# Altium schematic sheet ART-Pi_Connector.SchDoc: Expansion_Conn
size A3; DocumentNumber: 10; Revision: V1.5; SheetNumber: 10; SheetTotal: 11; PageSetup: Record=PageOptions|CenterHorizontal=True|CenterVertical=True|PrintScale=1.01|XCorrection=1.00|YCorrection=1.00|PrintKind=0|BorderSize=5000000|LeftOffset=0|BottomOffset=0|Orientation=2|PaperLength=1000|PaperWidth=1000|Scale=100|PaperSource=7|PrintQuality=600|MediaType=1|DitherType=10|PrintScaleMode=1|PaperKind=A3(297x420mm)|PaperIndex=8
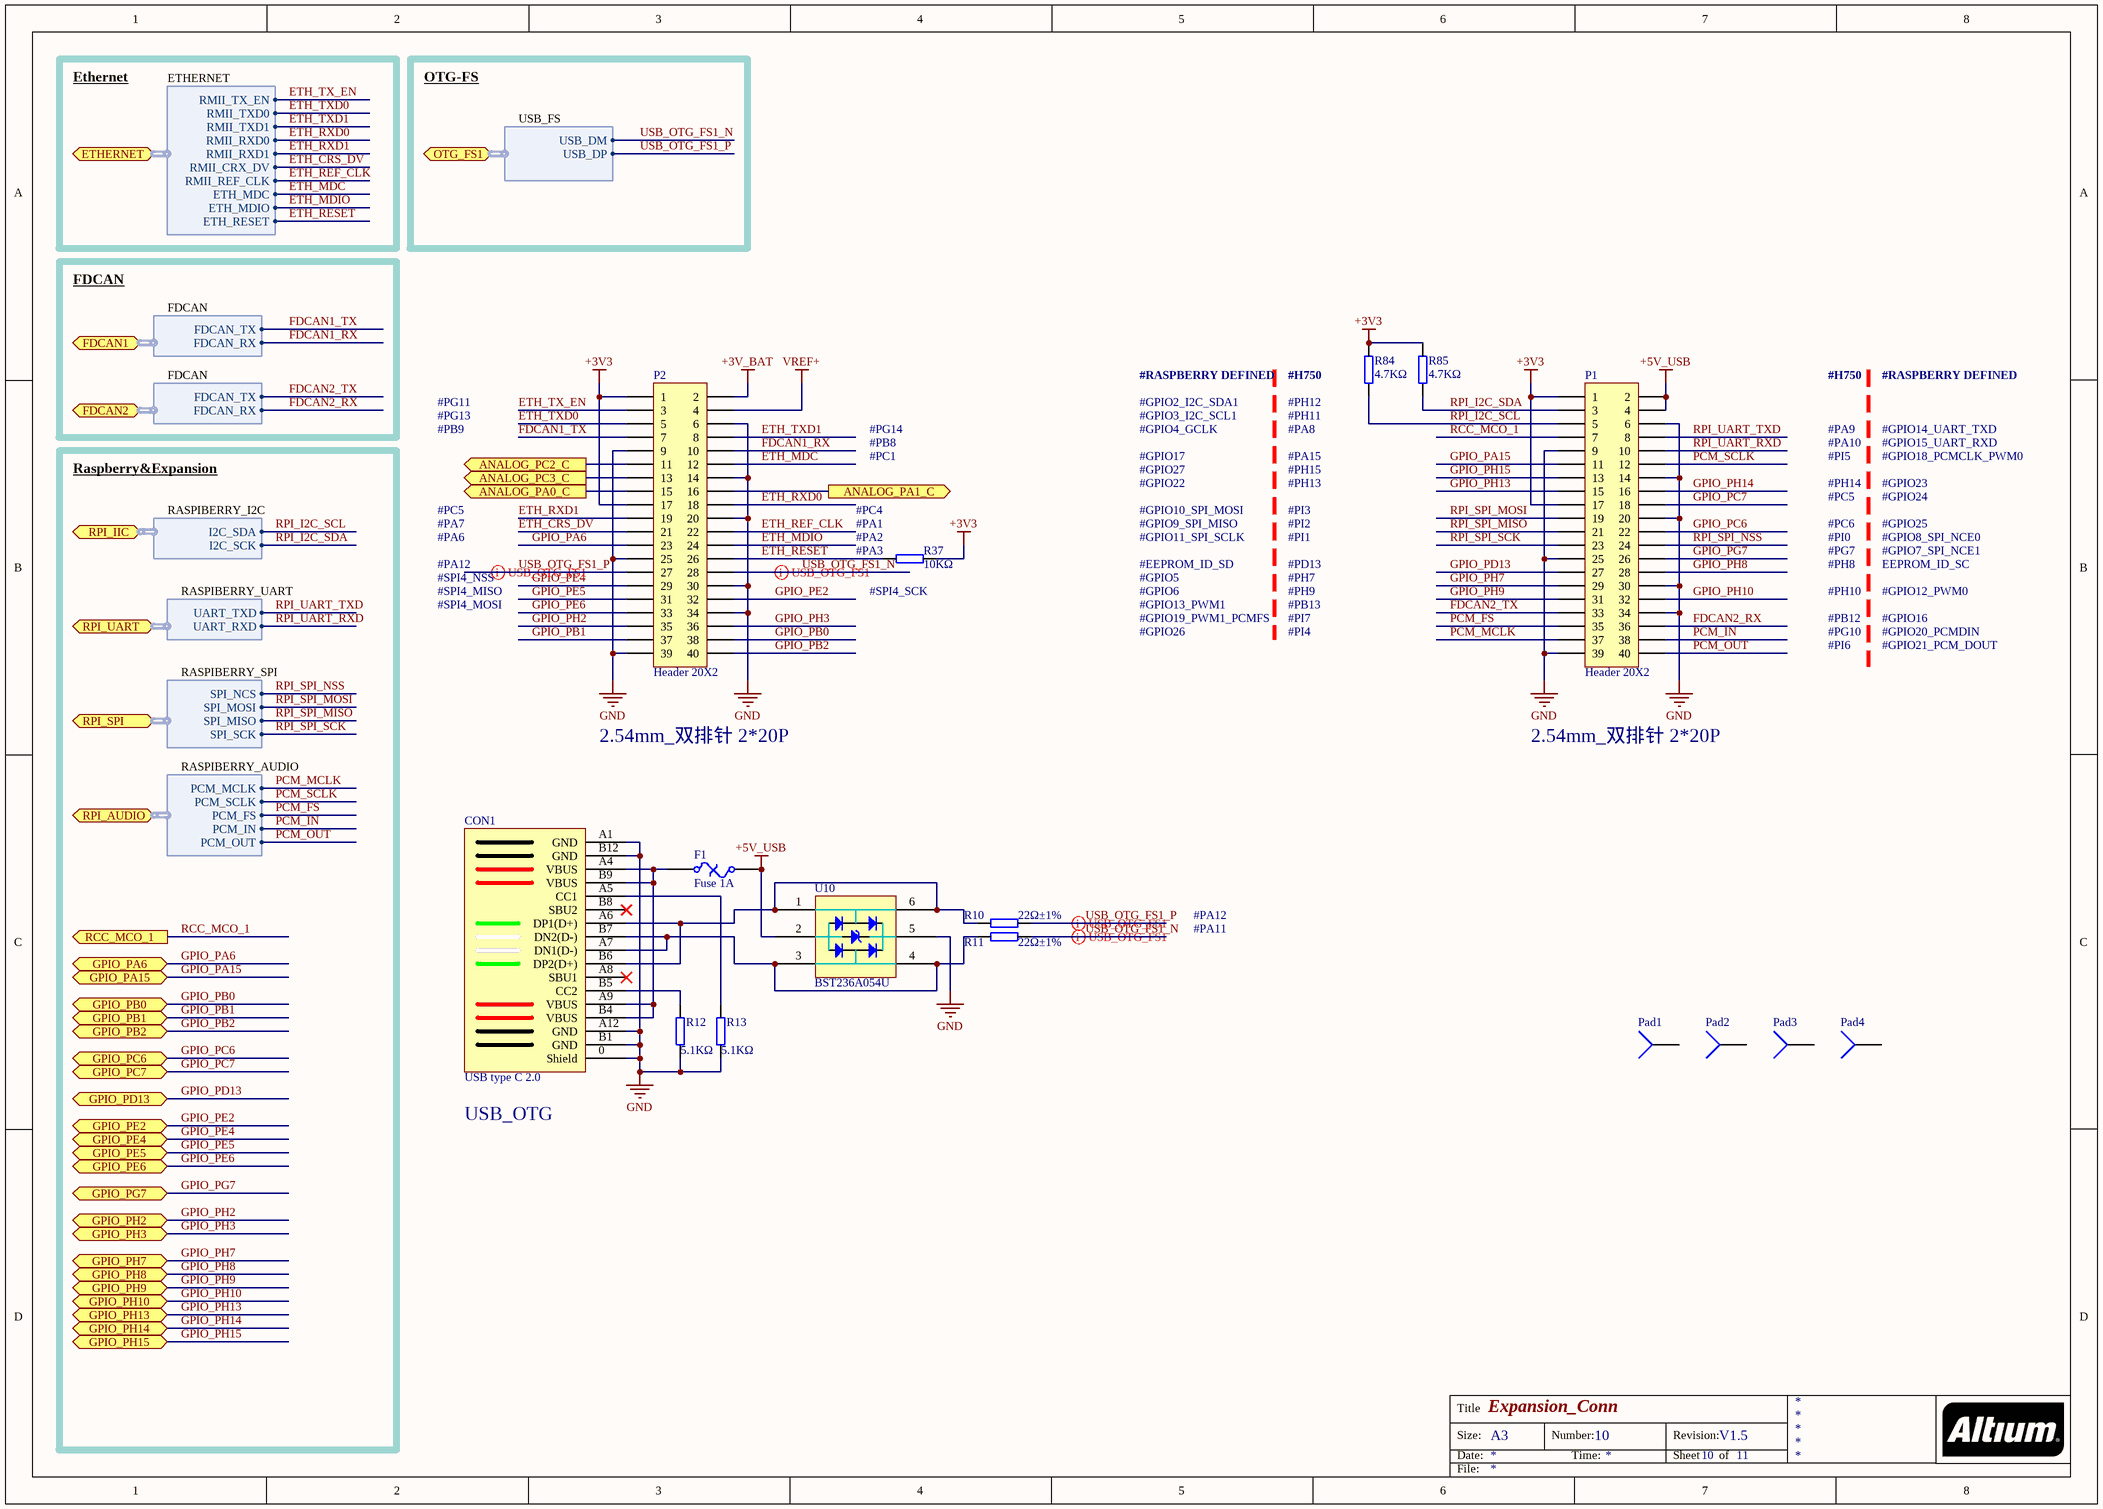
[diagram p0: ART-Pi_Connector.SchDoc]

## Parts
CON1  USB type C 2.0  [USB_C]
F1  Fuse 1A  [0805_R]
P1  Header 20X2  [HDR2X20]
P2  Header 20X2  [HDR2X20]
Pad1  Socket  [Pad-3mm]  (value not drawn)
Pad2  Socket  [Pad-3mm]  (value not drawn)
Pad3  Socket  [Pad-3mm]  (value not drawn)
Pad4  Socket  [Pad-3mm]  (value not drawn)
R10  22Ω±1%  [0402_R]
R11  22Ω±1%  [0402_R]
R12  5.1KΩ  [0402_R]
R13  5.1KΩ  [0402_R]
R37  10KΩ  [0402_R]
R84  4.7KΩ  [0402_R]
R85  4.7KΩ  [0402_R]
U10  BST236A054U  [SOT23_6]

## Ports
ANALOG_PA0_C (out), ANALOG_PA1_C (out), ANALOG_PC2_C (out), ANALOG_PC3_C (out), ETHERNET (harness Harness), FDCAN1 (harness Harness), FDCAN2 (harness Harness), GPIO_PA6 (bidir), GPIO_PA15 (bidir), GPIO_PB0 (bidir), GPIO_PB1 (bidir), GPIO_PB2 (bidir), GPIO_PC6 (bidir), GPIO_PC7 (bidir), GPIO_PD13 (bidir), GPIO_PE2 (bidir), GPIO_PE4 (bidir), GPIO_PE5 (bidir), GPIO_PE6 (bidir), GPIO_PG7 (bidir), GPIO_PH2 (bidir), GPIO_PH3 (bidir), GPIO_PH7 (bidir), GPIO_PH8 (bidir), GPIO_PH9 (bidir), GPIO_PH10 (bidir), GPIO_PH13 (bidir), GPIO_PH14 (bidir), GPIO_PH15 (bidir), OTG_FS1 (harness Harness), RCC_MCO_1 (out), RPI_AUDIO (harness Harness), RPI_IIC (harness Harness), RPI_SPI (harness Harness), RPI_UART (harness Harness)

## Harnesses
Harness: USB_DM, USB_DP
Harness: FDCAN_TX, FDCAN_RX
Harness: UART_TXD, UART_RXD
Harness: SPI_NCS, SPI_MOSI, SPI_MISO, SPI_SCK
Harness: PCM_MCLK, PCM_SCLK, PCM_FS, PCM_IN, PCM_OUT
Harness: RMII_TX_EN, RMII_TXD0, RMII_TXD1, RMII_RXD0, RMII_RXD1, RMII_CRX_DV, RMII_REF_CLK, ETH_MDC, ETH_MDIO, ETH_RESET
Harness: I2C_SCK, I2C_SDA

## Nets
+3V3: P1.1 P1.17 P2.1 P2.17 R37.1 R84.1 R85.1
+3V_BAT: P2.2
+5V_USB: F1.2 P1.2 P1.4 U10.2
GND: CON1.0(Shield) CON1.A1(GND) CON1.A12(GND) CON1.B1(GND) CON1.B12(GND) P1.6 P1.9 P1.14 P1.20 P1.25 P1.30 P1.34 P1.39 P2.6 P2.9 P2.14 P2.20 P2.25 P2.30 P2.34 P2.39 R12.2 R13.2 U10.5
VREF+: P2.4
ANALOG_PA0_C: P2.15 ; port ANALOG_PA0_C
ANALOG_PA1_C: P2.16 ; port ANALOG_PA1_C
ANALOG_PC2_C: P2.11 ; port ANALOG_PC2_C
ANALOG_PC3_C: P2.13 ; port ANALOG_PC3_C
ETH_CRS_DV: P2.21 ; port ETHERNET.RMII_CRX_DV
ETH_MDC: P2.12 ; port ETHERNET.ETH_MDC
ETH_MDIO: P2.24 ; port ETHERNET.ETH_MDIO
ETH_REF_CLK: P2.22 ; port ETHERNET.RMII_REF_CLK
ETH_RESET: P2.26 R37.2 ; port ETHERNET.ETH_RESET
ETH_RXD0: P2.18 ; port ETHERNET.RMII_RXD0
ETH_RXD1: P2.19 ; port ETHERNET.RMII_RXD1
ETH_TX_EN: P2.3 ; port ETHERNET.RMII_TX_EN
ETH_TXD0: P2.5 ; port ETHERNET.RMII_TXD0
ETH_TXD1: P2.8 ; port ETHERNET.RMII_TXD1
FDCAN1_RX: P2.10 ; port FDCAN1.FDCAN_RX
FDCAN1_TX: P2.7 ; port FDCAN1.FDCAN_TX
FDCAN2_RX: P1.36 ; port FDCAN2.FDCAN_RX
FDCAN2_TX: P1.33 ; port FDCAN2.FDCAN_TX
GPIO_PA6: P2.23 ; port GPIO_PA6
GPIO_PA15: P1.11 ; port GPIO_PA15
GPIO_PB0: P2.38 ; port GPIO_PB0
GPIO_PB1: P2.37 ; port GPIO_PB1
GPIO_PB2: P2.40 ; port GPIO_PB2
GPIO_PC6: P1.22 ; port GPIO_PC6
GPIO_PC7: P1.18 ; port GPIO_PC7
GPIO_PD13: P1.27 ; port GPIO_PD13
GPIO_PE2: P2.32 ; port GPIO_PE2
GPIO_PE4: P2.29 ; port GPIO_PE4
GPIO_PE5: P2.31 ; port GPIO_PE5
GPIO_PE6: P2.33 ; port GPIO_PE6
GPIO_PG7: P1.26 ; port GPIO_PG7
GPIO_PH2: P2.35 ; port GPIO_PH2
GPIO_PH3: P2.36 ; port GPIO_PH3
GPIO_PH7: P1.29 ; port GPIO_PH7
GPIO_PH8: P1.28 ; port GPIO_PH8
GPIO_PH9: P1.31 ; port GPIO_PH9
GPIO_PH10: P1.32 ; port GPIO_PH10
GPIO_PH13: P1.15 ; port GPIO_PH13
GPIO_PH14: P1.16 ; port GPIO_PH14
GPIO_PH15: P1.13 ; port GPIO_PH15
PCM_FS: P1.35 ; port RPI_AUDIO.PCM_FS
PCM_IN: P1.38 ; port RPI_AUDIO.PCM_IN
PCM_MCLK: P1.37 ; port RPI_AUDIO.PCM_MCLK
PCM_OUT: P1.40 ; port RPI_AUDIO.PCM_OUT
PCM_SCLK: P1.12 ; port RPI_AUDIO.PCM_SCLK
RCC_MCO_1: P1.7 ; port RCC_MCO_1
RPI_I2C_SCL: P1.5 R84.2 ; port RPI_IIC.I2C_SDA
RPI_I2C_SDA: P1.3 R85.2 ; port RPI_IIC.I2C_SCK
RPI_SPI_MISO: P1.21 ; port RPI_SPI.SPI_MISO
RPI_SPI_MOSI: P1.19 ; port RPI_SPI.SPI_MOSI
RPI_SPI_NSS: P1.24 ; port RPI_SPI.SPI_NCS
RPI_SPI_SCK: P1.23 ; port RPI_SPI.SPI_SCK
RPI_UART_RXD: P1.10 ; port RPI_UART.UART_RXD
RPI_UART_TXD: P1.8 ; port RPI_UART.UART_TXD
USB_OTG_FS1_N: P2.28 R11.2 ; port OTG_FS1.USB_DM
USB_OTG_FS1_P: P2.27 R10.2 ; port OTG_FS1.USB_DP
NetCON1_A4: CON1.A4(VBUS) CON1.A9(VBUS) CON1.B4(VBUS) CON1.B9(VBUS) F1.1
NetCON1_A5: CON1.A5(CC1) R13.1
NetCON1_A6: CON1.A6(DP1(D+)) CON1.B6(DP2(D+)) R10.1 U10.1 U10.6
NetCON1_A7: CON1.A7(DN1(D-)) CON1.B7(DN2(D-)) R11.1 U10.3 U10.4
NetCON1_B5: CON1.B5(CC2) R12.1

Not connected (* = marked no-connect by the designer): CON1 A8(SBU1)* B8(SBU2)*; Pad1 0; Pad2 0; Pad3 0; Pad4 0

## Layout directives
differential pair: USB_OTG_FS1_N, USB_OTG_FS1_P

## Notes on the sheet
- Ethernet
- ETHERNET
- OTG-FS
- USB_FS
- FDCAN
- #RASPBERRY DEFINED
- (near R84) #H750
- #H750
- #PG11
- #PG13
- #PB9
- #PG14
- #PB8
- #GPIO2_I2C_SDA1
- #GPIO3_I2C_SCL1
- #GPIO4_GCLK
- (near R84) #PH12
- #PH11
- #PA8
- #PA9
- #PA10
- #GPIO14_UART_TXD
- #GPIO15_UART_RXD
- Raspberry&Expansion
- RASPIBERRY_I2C
- #PC5
- (near R37) #PC4
- #PC1
- #GPIO17
- #GPIO27
- #GPIO22
- #GPIO10_SPI_MOSI
- #PA15
- #PH15
- #PH13
- #PI3
- #PI5
- #PH14
- #GPIO18_PCMCLK_PWM0
- #GPIO23
- #GPIO24
- #PA7
- #PA6
- #PA12
- #SPI4_NSS
- (near R37) #PA1
- (near R37) #PA2
- (near R37) #PA3
- #GPIO9_SPI_MISO
- #GPIO11_SPI_SCLK
- #EEPROM_ID_SD
- #GPIO5
- #PI2
- #PI1
- #PD13
- #PH7
- #PC6
- #PI0
- #PG7
- #PH8
- #GPIO25
- #GPIO8_SPI_NCE0
- #GPIO7_SPI_NCE1
- EEPROM_ID_SC
- RASPIBERRY_UART
- #SPI4_MISO
- #SPI4_MOSI
- (near R37) #SPI4_SCK
- #GPIO6
- #GPIO13_PWM1
- #GPIO19_PWM1_PCMFS
- #GPIO26
- #PH9
- #PB13
- #PI7
- #PI4
- #PH10
- #PB12
- #PG10
- #PI6
- #GPIO12_PWM0
- #GPIO16
- #GPIO20_PCMDIN
- #GPIO21_PCM_DOUT
- RASPIBERRY_SPI
- RASPIBERRY_AUDIO
- 2.54mm_双排针 2*20P
- #PA11
- USB_OTG
- Title
- Size:
- Date:
- A3
- Number:
- Time:
- Revision:
- Sheet
- of
- File:

## Library data of the parts
CON1 = USB type C
F1 = Fuse Thermal: Thermal Fuse; Published: 24-Mar-1999; LatestRevisionDate: 17-Jul-2002; LatestRevisionNote: Re-released for DXP Platform.; PackageReference: PIN-W2/E2.8; Publisher: Altium Limited; PackageDescription: Thru-Hole; 2 Leads
P1 P2 = Header 20X2: Header, 20-Pin, Dual row; LatestRevisionDate: 17-Jul-2002; LatestRevisionNote: Re-released for DXP Platform.; Publisher: Altium Limited
R10-R13 R37 R84 R85 = Res: Resister
Pad1-Pad4 = Socket: LatestRevisionDate: 17-Jul-2002; LatestRevisionNote: Re-released for DXP Platform.; Publisher: Altium Limited